# EAGLE design 8266_gpio_plus_adc (EAGLE 6.6.0)
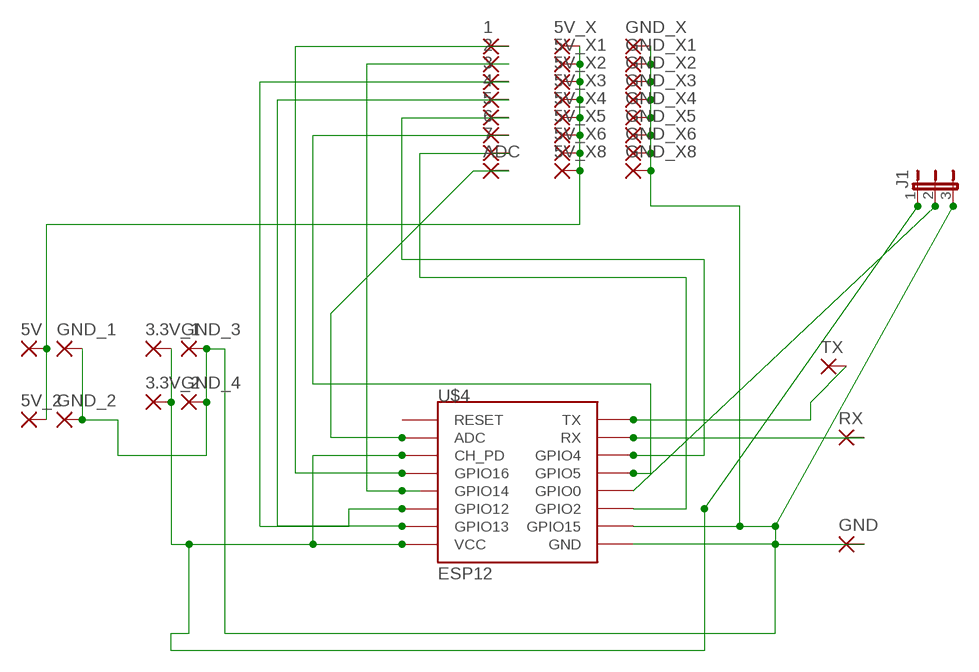
[diagram p0: schematic, sheet 1]

## Parts
1  2,15/1,0  [2,15/1,0]
2  2,15/1,0  [2,15/1,0]
3  2,15/1,0  [2,15/1,0]
3.3V_1  2,15/1,0  [2,15/1,0]
3.3V_2  2,15/1,0  [2,15/1,0]
4  2,15/1,0  [2,15/1,0]
5  2,15/1,0  [2,15/1,0]
5V  2,15/1,0  [2,15/1,0]
5V_2  2,15/1,0  [2,15/1,0]
5V_X  2,15/1,0  [2,15/1,0]
5V_X1  2,15/1,0  [2,15/1,0]
5V_X2  2,15/1,0  [2,15/1,0]
5V_X3  2,15/1,0  [2,15/1,0]
5V_X4  2,15/1,0  [2,15/1,0]
5V_X5  2,15/1,0  [2,15/1,0]
5V_X6  2,15/1,0  [2,15/1,0]
5V_X8  2,15/1,0  [2,15/1,0]
6  2,15/1,0  [2,15/1,0]
7  2,15/1,0  [2,15/1,0]
ADC  2,15/1,0  [2,15/1,0]
GND  2,15/1,0  [2,15/1,0]
GND_1  2,15/1,0  [2,15/1,0]
GND_2  2,15/1,0  [2,15/1,0]
GND_3  2,15/1,0  [2,15/1,0]
GND_4  2,15/1,0  [2,15/1,0]
GND_X  2,15/1,0  [2,15/1,0]
GND_X1  2,15/1,0  [2,15/1,0]
GND_X2  2,15/1,0  [2,15/1,0]
GND_X3  2,15/1,0  [2,15/1,0]
GND_X4  2,15/1,0  [2,15/1,0]
GND_X5  2,15/1,0  [2,15/1,0]
GND_X6  2,15/1,0  [2,15/1,0]
GND_X8  2,15/1,0  [2,15/1,0]
J1  JP2E  [JP2]
RX  2,15/1,0  [2,15/1,0]
TX  2,15/1,0  [2,15/1,0]
U$4  ESP12  [ESP12]

## Nets
5V: 5V.1(P) 5V_2.1(P) 5V_X1.1(P) 5V_X2.1(P) 5V_X3.1(P) 5V_X4.1(P) 5V_X5.1(P) 5V_X6.1(P) 5V_X8.1(P) 5V_X.1(P)
GND: GND.1(P) GND_1.1(P) GND_2.1(P) GND_3.1(P) GND_4.1(P) GND_X1.1(P) GND_X2.1(P) GND_X3.1(P) GND_X4.1(P) GND_X5.1(P) GND_X6.1(P) GND_X8.1(P) GND_X.1(P) J1.3 U$4.GND U$4.GPIO15
N$1: 2.1(P) U$4.GPIO14
N$2: J1.2 U$4.GPIO0
N$3: 3.1(P) U$4.GPIO12
N$4: 4.1(P) U$4.GPIO13
N$5: 3.3V_1.1(P) 3.3V_2.1(P) J1.1 U$4.CH_PD U$4.VCC
N$7: 1.1(P) U$4.GPIO16
N$8: 7.1(P) U$4.GPIO2
N$9: 6.1(P) U$4.GPIO5
N$10: 5.1(P) U$4.GPIO4
N$11: ADC.1(P) U$4.ADC
RX: RX.1(P) U$4.RX
TX: TX.1(P) U$4.TX
Unconnected: U$4.RESET

## Library data of the parts
1-3 3.3V_1 3.3V_2 4 5 5V 5V_2 5V_X 5V_X1-5V_X6 5V_X8 6 7 ADC GND GND_1-GND_4 GND_X GND_X1-GND_X6 GND_X8 RX TX = wirepad:2,15/1,0: THROUGH-HOLE PAD
J1 = jumper:JP2E: JUMPER
U$4 = esp8266modules:ESP12: ESP8266 Wifi module 12

## Board
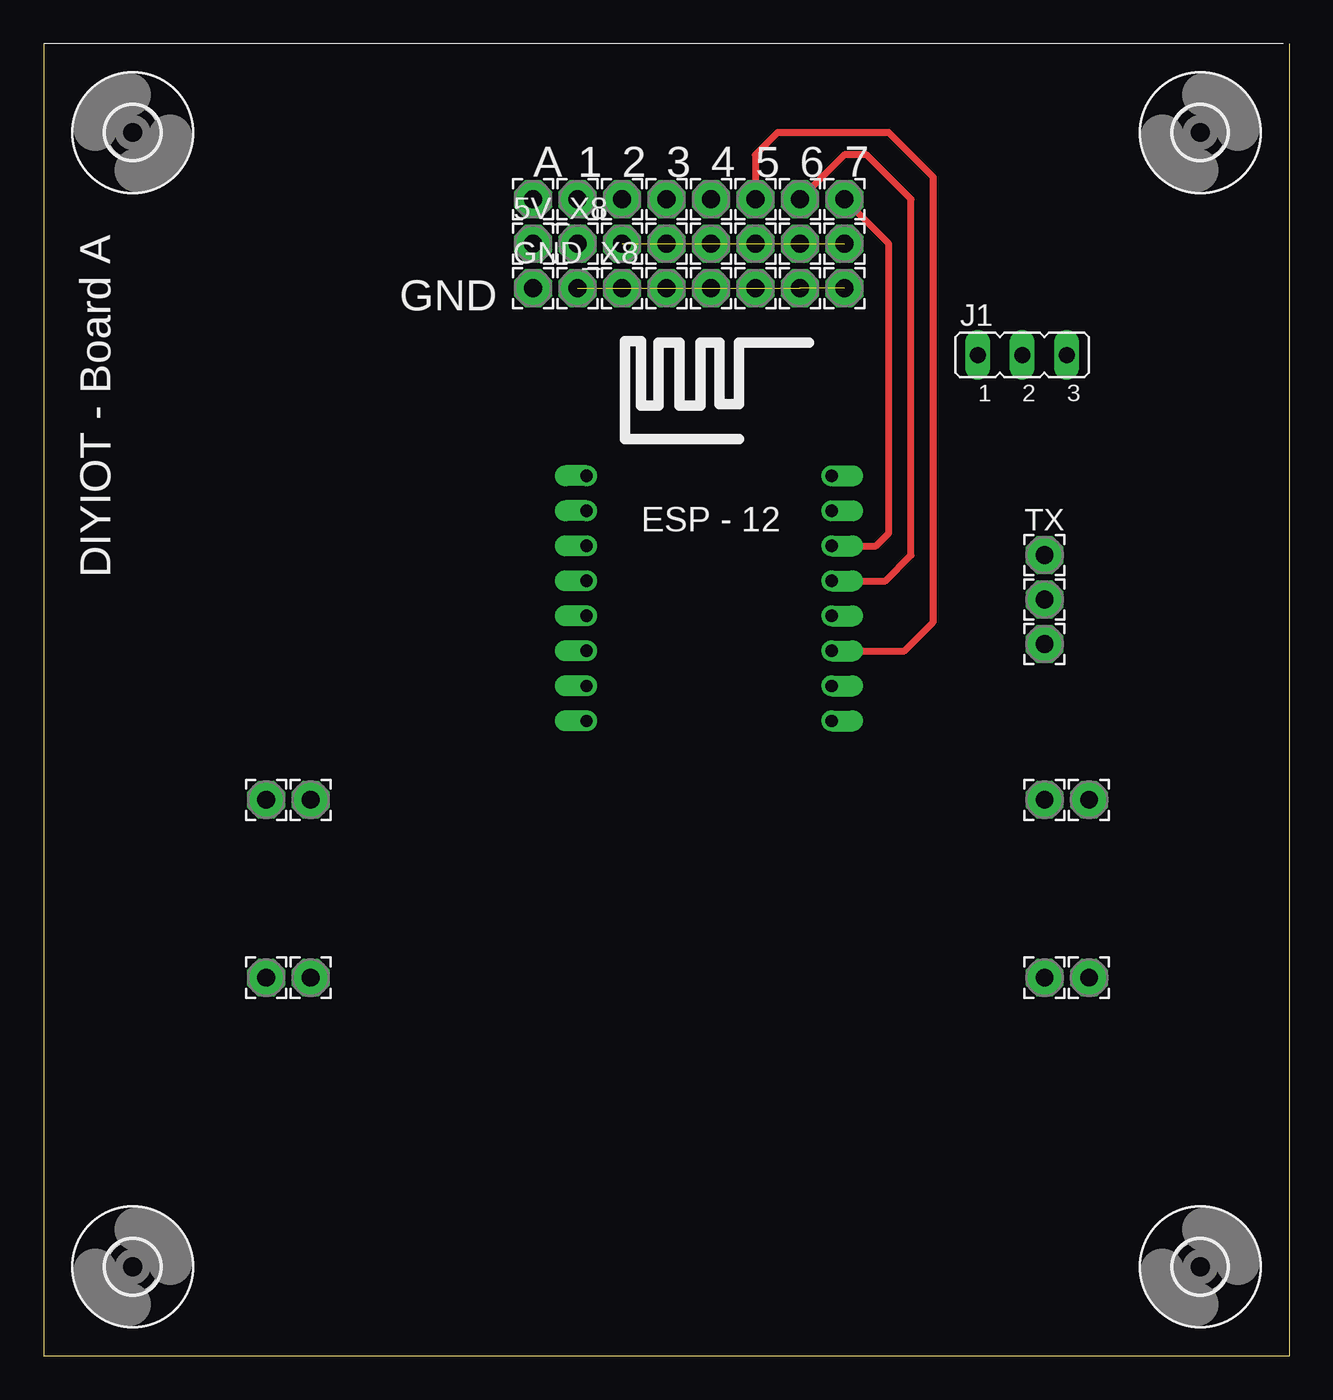
[diagram p1: board, top side]
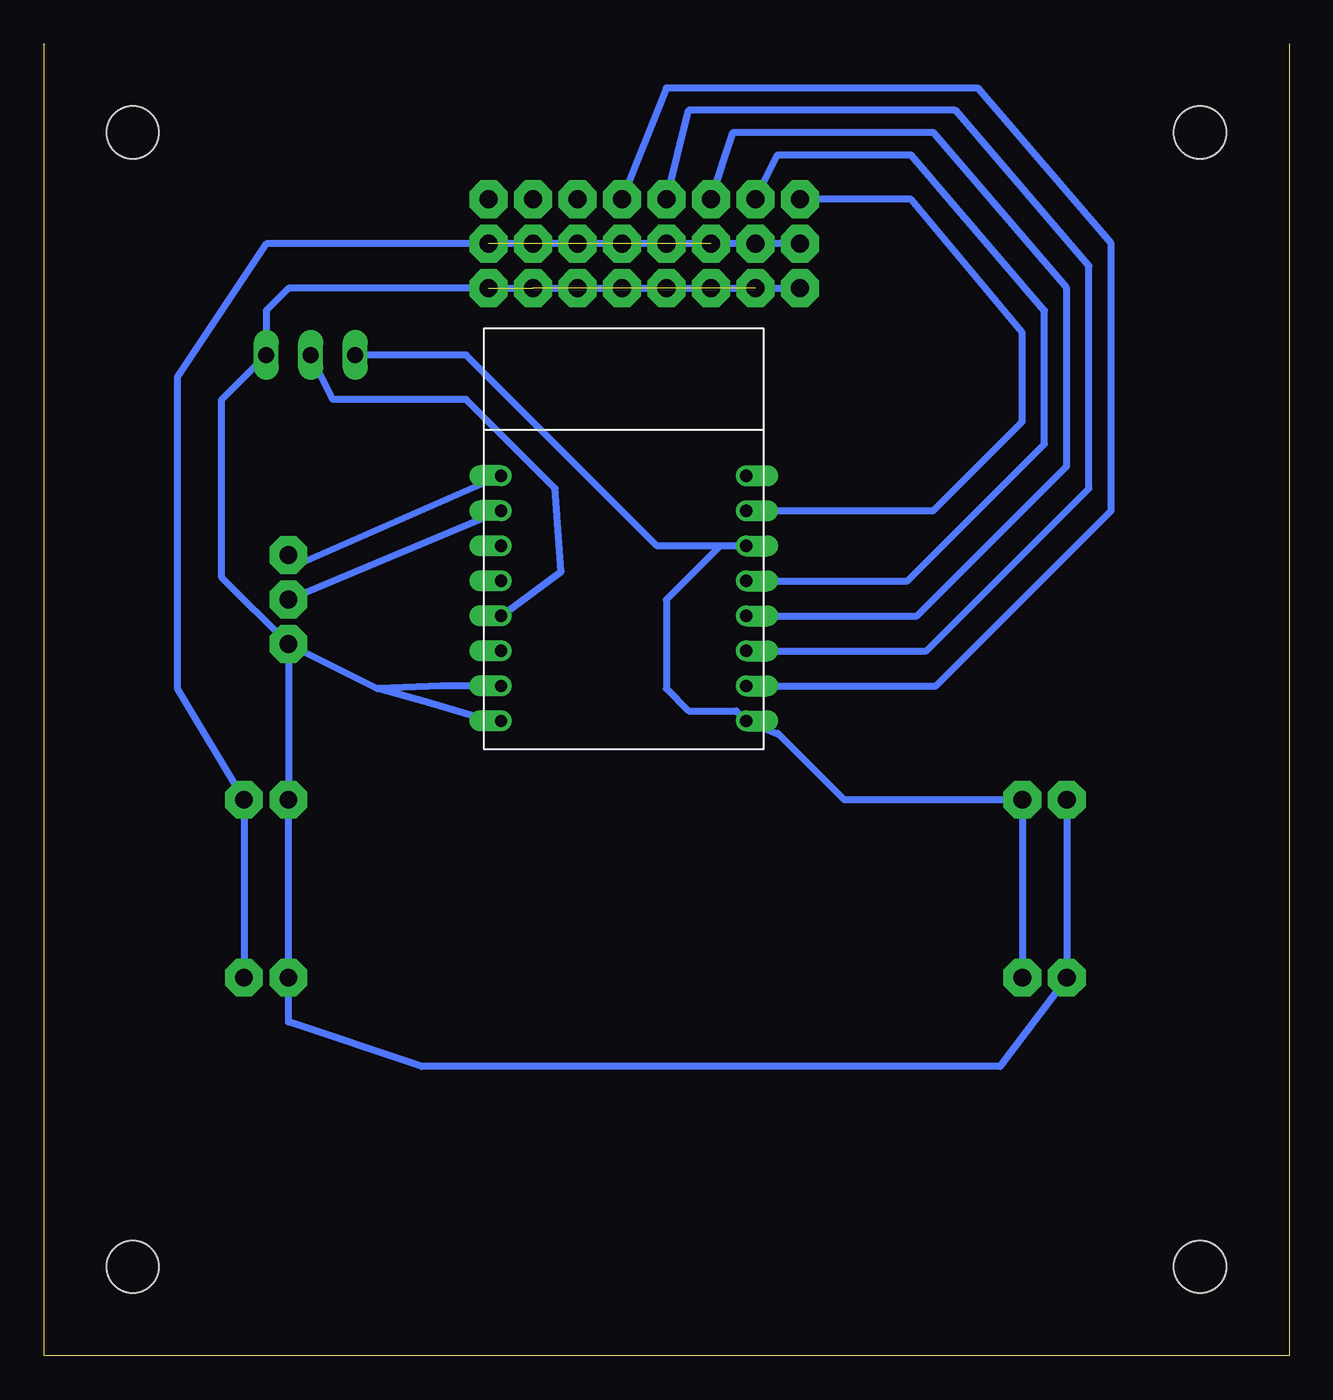
[diagram p2: board, bottom side, seen from below]

Size 71.12 x 74.92 mm. Coordinates in mm from the lower left corner, seen from the top.
Outline: 0,74.92 0,0 71.12,0 71.12,74.92
Copper layers (1*16): Top 0.035mm / dielectric 1.5mm / Bottom 0.035mm
Design rules "default *": minimum track width 10mil, minimum drill 13mil, track to track 8mil, track to pad 8mil, pad to pad 8mil, via to via 8mil, smd to smd 8mil, copper to edge 40mil, drill to drill 8mil, minimum pad ring 10mil, minimum via ring 8mil, stop-mask expansion 4mil, vias tented up to drill 0mil, thermal gap 10mil

### Footprints (pad centres in the part's own frame; a part is rotated, then mirrored left to right if it is on the bottom)
2,15/1,0 = drill 1.016 pad 2.159 octagon: 1 0,0
JP2 = drill 0.914 long: 1 -2.54,0; 2 0,0; 3 2.54,0
3,0 = hole 3: 0,0
ESP12 = drill 0.7 offset: ADC -7.1,3.8; CH_PD -7.1,1.8; GND 6.9,-8.2; GPIO0 6.9,-2.2; GPIO2 6.9,-4.2; GPIO4 6.9,1.8; GPIO5 6.9,-0.2; GPIO12 -7.1,-4.2; GPIO13 -7.1,-6.2; GPIO14 -7.1,-2.2; GPIO15 6.9,-6.2; GPIO16 -7.1,-0.2; RESET -7.1,5.8; RX 6.9,3.8; TX 6.9,5.8; VCC -7.1,-8.2

### Placement (x,y rotation side)
1  30.48,66.04 0 top
2  33.02,66.04 0 top
3  35.56,66.04 0 top
3.3V_1  15.24,21.59 0 top
3.3V_2  15.24,31.75 0 top
4  38.1,66.04 0 top
5  45.72,66.04 0 top
5V  59.69,31.75 0 top
5V_2  59.69,21.59 0 top
5V_X  45.72,63.5 0 top
5V_X1  43.18,63.5 0 top
5V_X2  40.64,63.5 0 top
5V_X3  38.1,63.5 0 top
5V_X4  35.56,63.5 0 top
5V_X5  33.02,63.5 0 top
5V_X6  30.48,63.5 0 top
5V_X8  27.94,63.5 0 top
6  43.18,66.04 0 top
7  40.64,66.04 0 top
ADC  27.94,66.04 0 top
GND  57.15,31.75 0 top
GND_1  57.15,21.59 0 top
GND_2  12.7,21.59 0 top
GND_3  57.15,40.64 0 top
GND_4  12.7,31.75 0 top
GND_X  45.72,60.96 0 top
GND_X1  43.18,60.96 0 top
GND_X2  40.64,60.96 0 top
GND_X3  38.1,60.96 0 top
GND_X4  35.56,60.96 0 top
GND_X5  33.02,60.96 0 top
GND_X6  30.48,60.96 0 top
GND_X8  27.94,60.96 0 top
J1  55.88,57.15 0 top
RX  57.15,43.18 0 top
TX  57.15,45.72 0 top
U$1  [3,0]  5.08,69.85 90 top
U$2  [3,0]  5.08,5.08 0 top
U$4  38.1,44.45 0 top
U$5  [3,0]  66.04,5.08 0 top
U$6  [3,0]  66.04,69.85 0 top

### Tracks (layer width: path | path; a pad name or v marks a point on that pad's centre or on a via)
5V  (5 unrouted)
  Bottom 0.406: 5V_2.1 5V.1 63.5,38.1 63.5,55.88 58.42,63.5 5V_X5.1 | 5V_X6.1 5V_X5.1 | 5V_X8.1 5V_X5.1
GND  (6 unrouted)
  Bottom 0.406: GND_3.1 GND.1 GND_1.1 57.15,19.05 49.53,16.51 16.51,16.51 GND_2.1 GND_4.1 | GND_3.1 52.07,38.1 | 52.07,38.1 49.28,37.34 45.65,36.25 U$4.GND | U$4.GPIO15 48.41,38.25 52.07,38.1 | GND_3.1 60.96,44.45 60.96,54.61 J1.3 58.42,59.69 57.15,60.96 GND_X.1 GND_X8.1
N$1
  Bottom 0.406: U$4.GPIO14 21.25,42.25 12.7,50.8 12.7,60.96 20.32,69.85 31.75,69.85 2.1
N$2
  Bottom 0.406: U$4.GPIO0 41.57,44.79 41.91,49.53 46.99,54.61 54.61,54.61 J1.2
N$3
  Bottom 0.406: U$4.GPIO12 20.71,40.25 11.43,49.53 11.43,62.23 19.05,71.12 34.29,71.12 3.1
N$4
  Bottom 0.406: U$4.GPIO13 20.17,38.25 10.16,48.26 10.16,63.5 17.78,72.39 35.56,72.39 4.1
N$5
  Bottom 0.406: 3.3V_1.1 3.3V_2.1 25.4,31.75 29.21,35.56 29.21,35.5 U$4.VCC 31.58,36.83 34.29,36.83 35.56,38.1 35.56,43.18 32.49,46.25 U$4.CH_PD 36.09,46.25 46.99,57.15 J1.1
N$7
  Bottom 0.406: U$4.GPIO16 21.79,44.25 13.97,52.07 13.97,59.69 21.59,68.58 29.21,68.58 1.1
N$8
  Top 0.406: U$4.GPIO2 49.14,40.25 50.8,41.91 50.8,67.31 48.26,69.85 41.91,69.85 40.64,68.58 7.1
N$9
  Top 0.406: U$4.GPIO5 48.06,44.25 49.53,45.72 49.53,66.04 46.99,68.58 45.72,68.58 6.1
N$10
  Top 0.406: U$4.GPIO4 47.52,46.25 48.26,46.99 48.26,63.5 5.1
N$11
  Bottom 0.406: U$4.ADC 26.67,48.25 20.32,48.26 15.24,53.34 15.24,58.42 21.59,66.04 ADC.1
RX
  Bottom 0.406: U$4.RX RX.1
TX
  Bottom 0.406: U$4.TX 56.6,45.17 TX.1

### Text on the board
tNames: A | 1 | 2 | 3 | 4 | 5 | 6 | 7 | GND | DIYIOT - Board A